# EAGLE design Roboduino DIP PTH (EAGLE 5.07)
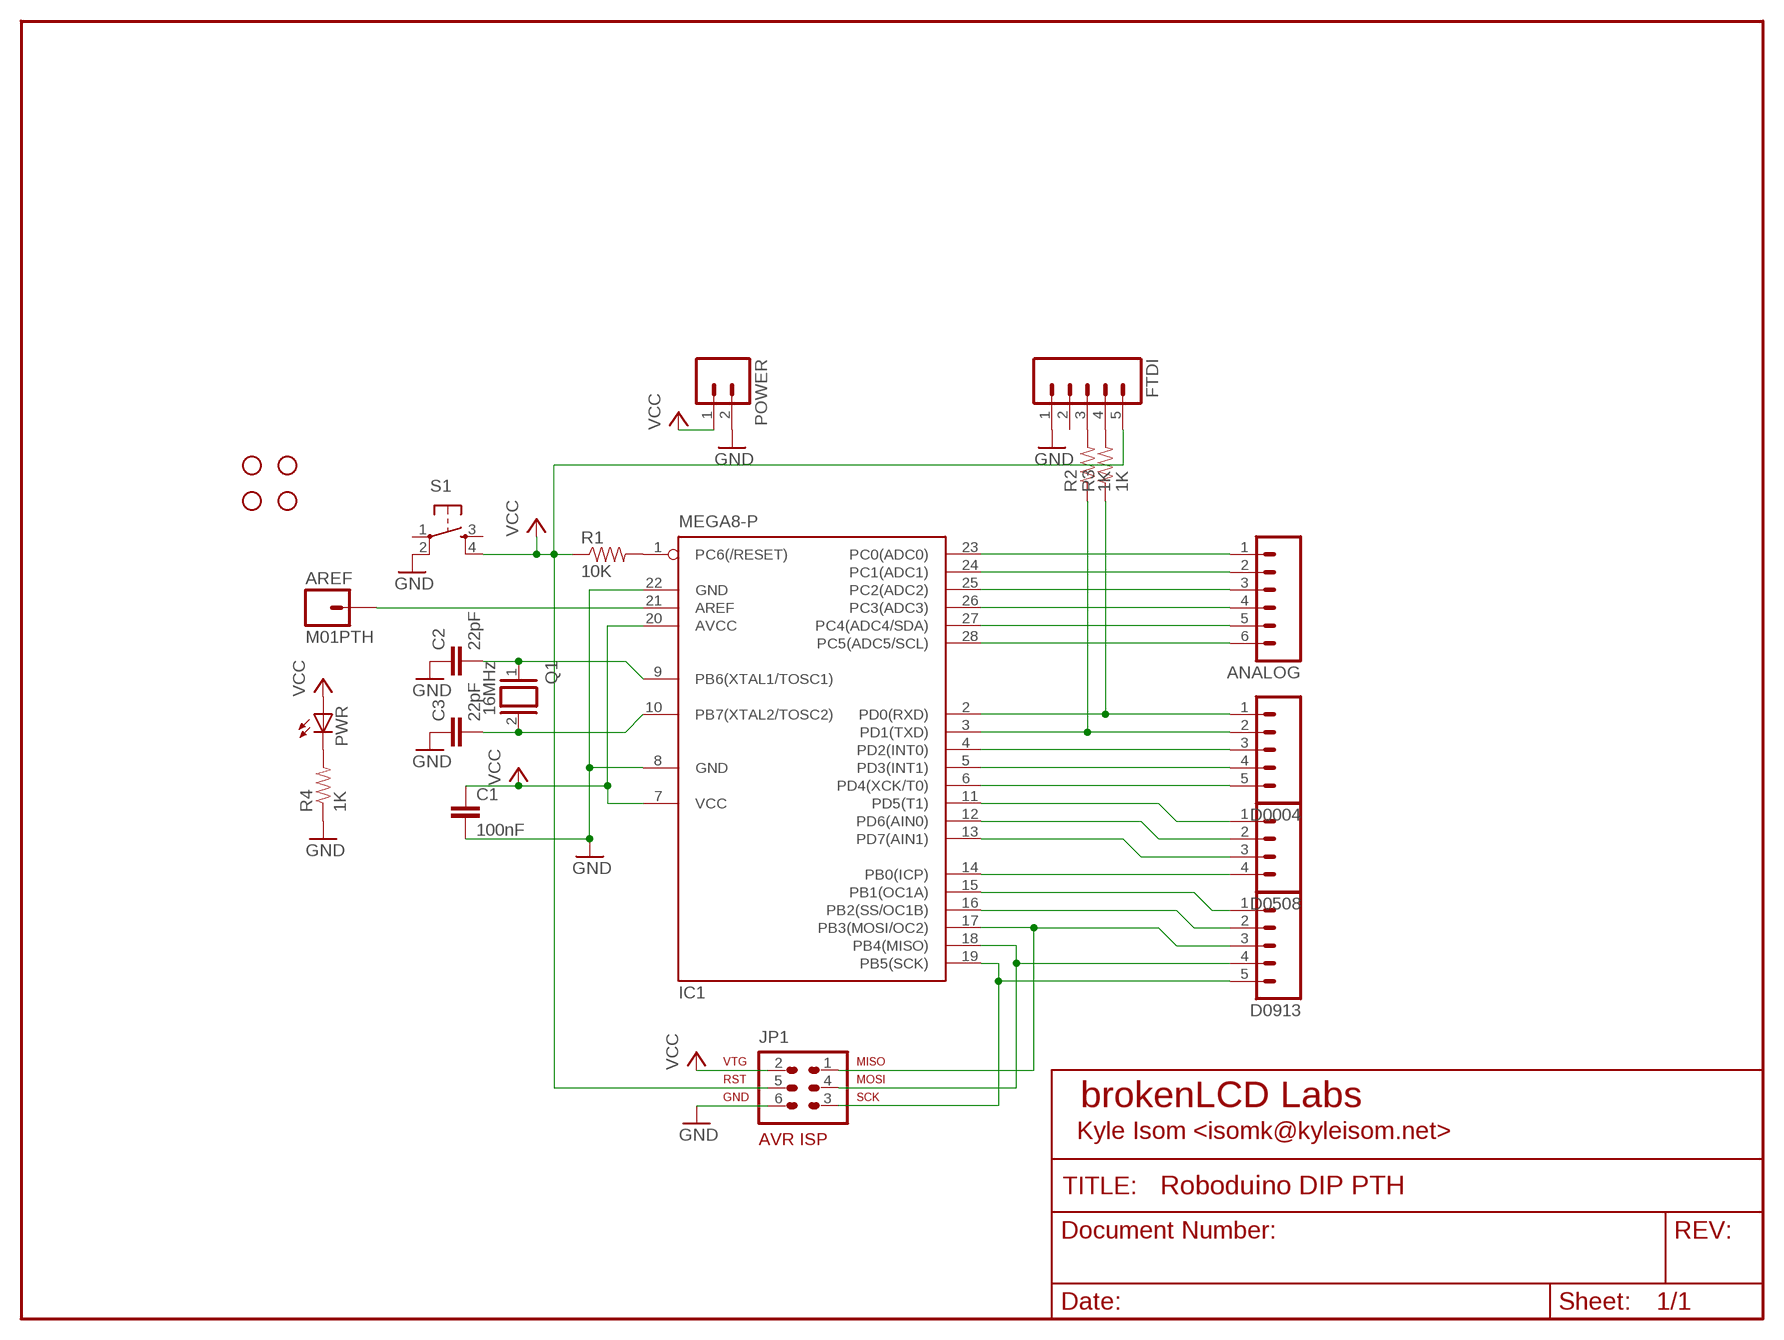
[diagram p0: schematic, sheet 1]

## Parts
ANALOG  M06LOCK  [1X06_LOCK]
AREF  M01PTH  [1X01]
C1  100nF  CAPPTH1  [CAP-PTH-5MM]
C2  22pF  CAPPTH1  [CAP-PTH-5MM]
C3  22pF  CAPPTH1  [CAP-PTH-5MM]
D0004  M05LOCK  [1X05_LOCK]
D0508  M04LOCK  [1X04_LOCK]
D0913  M05LOCK  [1X05_LOCK]
FTDI  M05LOCK  [1X05_LOCK]
IC1  MEGA8-P  [DIL28-3]
JP1  AVR-ISP-6  [AVR-ISP-6]
POWER  M02LOCK  [1X02_LOCK]
PWR  LED3MM  [LED3MM]
Q1  16MHz  XTAL/S  [QS]
R1  10K  RESISTORPTH1  [AXIAL-0.3]
R2  1K  RESISTORPTH1  [AXIAL-0.3]
R3  1K  RESISTORPTH1  [AXIAL-0.3]
R4  1K  RESISTORPTH1  [AXIAL-0.3]
S1  TAC_SWITCHPTH  [TACTILE-PTH]
U$1  STANDOFF  [STANDOFF]
U$2  STANDOFF  [STANDOFF]
U$3  STANDOFF  [STANDOFF]
U$4  STANDOFF  [STANDOFF]

## Nets
GND: C1.2 C2.1 C3.1 FTDI.1 IC1.8(GND) IC1.22(GND) JP1.6 POWER.2 R4.P$1 S1.2
N$1: IC1.1(PC6(/RESET)) R1.P$2
N$2: D0508.2 IC1.12(PD6(AIN0))
N$3: C2.2 IC1.9(PB6(XTAL1/TOSC1)) Q1.1
N$4: C3.2 IC1.10(PB7(XTAL2/TOSC2)) Q1.2
N$5: D0004.1 IC1.2(PD0(RXD)) R3.P$1
N$6: D0004.2 IC1.3(PD1(TXD)) R2.P$1
N$7: D0004.3 IC1.4(PD2(INT0))
N$8: D0004.4 IC1.5(PD3(INT1))
N$9: D0004.5 IC1.6(PD4(XCK/T0))
N$10: D0913.3 IC1.17(PB3(MOSI/OC2)) JP1.1
N$11: D0913.4 IC1.18(PB4(MISO)) JP1.4
N$12: D0913.5 IC1.19(PB5(SCK)) JP1.3
N$13: D0508.1 IC1.11(PD5(T1))
N$14: D0508.3 IC1.13(PD7(AIN1))
N$15: D0508.4 IC1.14(PB0(ICP))
N$16: D0913.1 IC1.15(PB1(OC1A))
N$17: D0913.2 IC1.16(PB2(SS/OC1B))
N$18: AREF.1 IC1.21(AREF)
N$19: ANALOG.1 IC1.23(PC0(ADC0))
N$20: ANALOG.2 IC1.24(PC1(ADC1))
N$21: ANALOG.3 IC1.25(PC2(ADC2))
N$22: ANALOG.4 IC1.26(PC3(ADC3))
N$23: ANALOG.5 IC1.27(PC4(ADC4/SDA))
N$24: ANALOG.6 IC1.28(PC5(ADC5/SCL))
N$25: PWR.K(C) R4.P$2
N$26: FTDI.3 R2.P$2
N$27: FTDI.4 R3.P$2
VCC: C1.1 FTDI.5 IC1.7(VCC) IC1.20(AVCC) JP1.2 JP1.5 POWER.1 PWR.A R1.P$1 S1.4
Unconnected: FTDI.2 S1.1 S1.3

## Notes on the sheet
- brokenLCD Labs
- Kyle Isom <isomk@kyleisom.net>

## Library data of the parts
ANALOG = SparkFun:M06: Header 6 Standard 6-pin 0.1" header. Use with straight break away headers (SKU : PRT-00116), right angle break away headers (PRT-00553), swiss pins (PRT-00743), machine pins (PRT-00117), and female headers (PRT-00115). Molex polarized connector foot print use with SKU : PRT-08094 with associated crimp pins and housings. NOTES ON THE VARIANTS LOCK and LOCK_LONGPADS... This footprint was designed to help hold the alignment of a through-hole component (i.e. 6-pin header) while soldering it into place. You may notice that each hole has been shifted either up or down by 0.005 of an inch from it's more standard position (which is a perfectly straight line). This slight alteration caused the pins (the squares in the middle) to touch the edges of the holes. Because they are alternating, it causes a "brace" to hold the component in place. 0.005 has proven to be the perfect amount of "off-center" position when using our standard breakaway headers. Although looks a little odd when you look at the bare footprint, once you have a header in there, the alteration is very hard to notice. Also, if you push a header all the way into place, it is covered up entirely on the bottom side. This idea of altering the position of holes to aid alignment will be further integrated into the Sparkfun Library for other footprints. It can help hold any component with 3 or more connection pins.
AREF = SparkFun:M01: Header 1 Standard 1-pin 0.1" header. Use with straight break away headers (SKU : PRT-00116), right angle break away headers (PRT-00553), swiss pins (PRT-00743), machine pins (PRT-00117), and female headers (PRT-00115).
C1-C3 = SparkFun:CAP: Capacitor Standard 0603 ceramic capacitor, and 0.1" leaded capacitor.
D0004 D0913 FTDI = SparkFun:M05: Header 5 Standard 5-pin 0.1" header. Use with straight break away headers (SKU : PRT-00116), right angle break away headers (PRT-00553), swiss pins (PRT-00743), machine pins (PRT-00117), and female headers (PRT-00115). Molex polarized connector foot print use with SKU : PRT-08230 with associated crimp pins and housings.
D0508 = SparkFun:M04: Header 4 Standard 4-pin 0.1" header. Use with straight break away headers (SKU : PRT-00116), right angle break away headers (PRT-00553), swiss pins (PRT-00743), machine pins (PRT-00117), and female headers (PRT-00115). Molex polarized connector foot print use with SKU : PRT-08231 with associated crimp pins and housings.
IC1 = atmel:MEGA8-P: MICROCONTROLLER 8 Kbytes FLASH, 1 kbytes SRAM, 512 bytes EEPROM, USART, 4-channel 10 bit ADC, 2-channel 8 bit ADC Pin compatible with Atmega48, ATMega88, ATMega168 Source: avr.lbr
JP1 = avr-6:AVR-ISP-6: AVR ISP-6 Serial Programming Header
POWER = SparkFun:M02: Header 2 Standard 2-pin 0.1" header. Use with straight break away headers (SKU : PRT-00116), right angle break away headers (PRT-00553), swiss pins (PRT-00743), machine pins (PRT-00117), and female headers (PRT-00115). Molex polarized connector foot print use with SKU : PRT-08233 with associated crimp pins and housings.
PWR = led:LED: LED OSRAM: - CHIPLED LG R971, LG N971, LY N971, LG Q971, LY Q971, LO R971, LY R971 LH N974, LH R974 LS Q976, LO Q976, LY Q976 LO Q996 - Hyper CHIPLED LW Q18S LB Q993, LB Q99A, LB R99A - SideLED LS A670, LO A670, LY A670, LG A670, LP A670 LB A673, LV A673, LT A673, LW A673 LH A674 LY A675 LS A676, LA A676, LO A676, LY A676, LW A676 LS A679, LY A679, LG A679 - Hyper Micro SIDELED® LS Y876, LA Y876, LO Y876, LY Y876 LT Y87S - SmartLED LW L88C, LW L88S LB L89C, LB L89S, LG L890 LS L89K, LO L89K, LY L89K LS L896, LA L896, LO L896, LY L896 - TOPLED LS T670, LO T670, LY T670, LG T670, LP T670 LSG T670, LSP T670, LSY T670, LOP T670, LYG T670 LG T671, LOG T671, LSG T671 LB T673, LV T673, LT T673, LW T673 LH T674 LS T676, LA T676, LO T676, LY T676, LB T676, LH T676, LSB T676, LW T676 LB T67C, LV T67C, LT T67C, LS T67K, LO T67K, LY T67K, LW E67C LS E67B, LA E67B, LO E67B, LY E67B, LB E67C, LV E67C, LT E67C LW T67C LS T679, LY T679, LG T679 LS T770, LO T770, LY T770, LG T770, LP T770 LB T773, LV T773, LT T773, LW T773 LH T774 LS E675, LA E675, LY E675, LS T675 LS T776, LA T776, LO T776, LY T776, LB T776 LHGB T686 LT T68C, LB T68C - Hyper Mini TOPLED® LB M676 - Mini TOPLED Santana® LG M470 LS M47K, LO M47K, LY M47K Source: http://www.osram.convergy.de LUXEON: - LUMILED® LXK2-PW12-R00, LXK2-PW12-S00, LXK2-PW14-U00, LXK2-PW14-V00 LXK2-PM12-R00, LXK2-PM12-S00, LXK2-PM14-U00 LXK2-PE12-Q00, LXK2-PE12-R00, LXK2-PE12-S00, LXK2-PE14-T00, LXK2-PE14-U00 LXK2-PB12-K00, LXK2-PB12-L00, LXK2-PB12-M00, LXK2-PB14-N00, LXK2-PB14-P00, LXK2-PB14-Q00 LXK2-PR12-L00, LXK2-PR12-M00, LXK2-PR14-Q00, LXK2-PR14-R00 LXK2-PD12-Q00, LXK2-PD12-R00, LXK2-PD12-S00 LXK2-PH12-R00, LXK2-PH12-S00 LXK2-PL12-P00, LXK2-PL12-Q00, LXK2-PL12-R00 Source: www.luxeon.com KINGBRIGHT: KA-3528ASYC Source: www.kingbright.com
Q1 = special:XTAL/S: CRYSTAL
R1-R4 = SparkFun:RESISTOR: Resistor Basic schematic elements and footprints for 0603, 1206, and PTH 1/10th watt (small) resistors.
S1 = SparkFun:TAC_SWITCH: Momentary Switch Button commonly used for reset or general input. Spark Fun Electronics SKU : COM-00097
U$1-U$4 = brokenlcd:STANDOFF

## Board
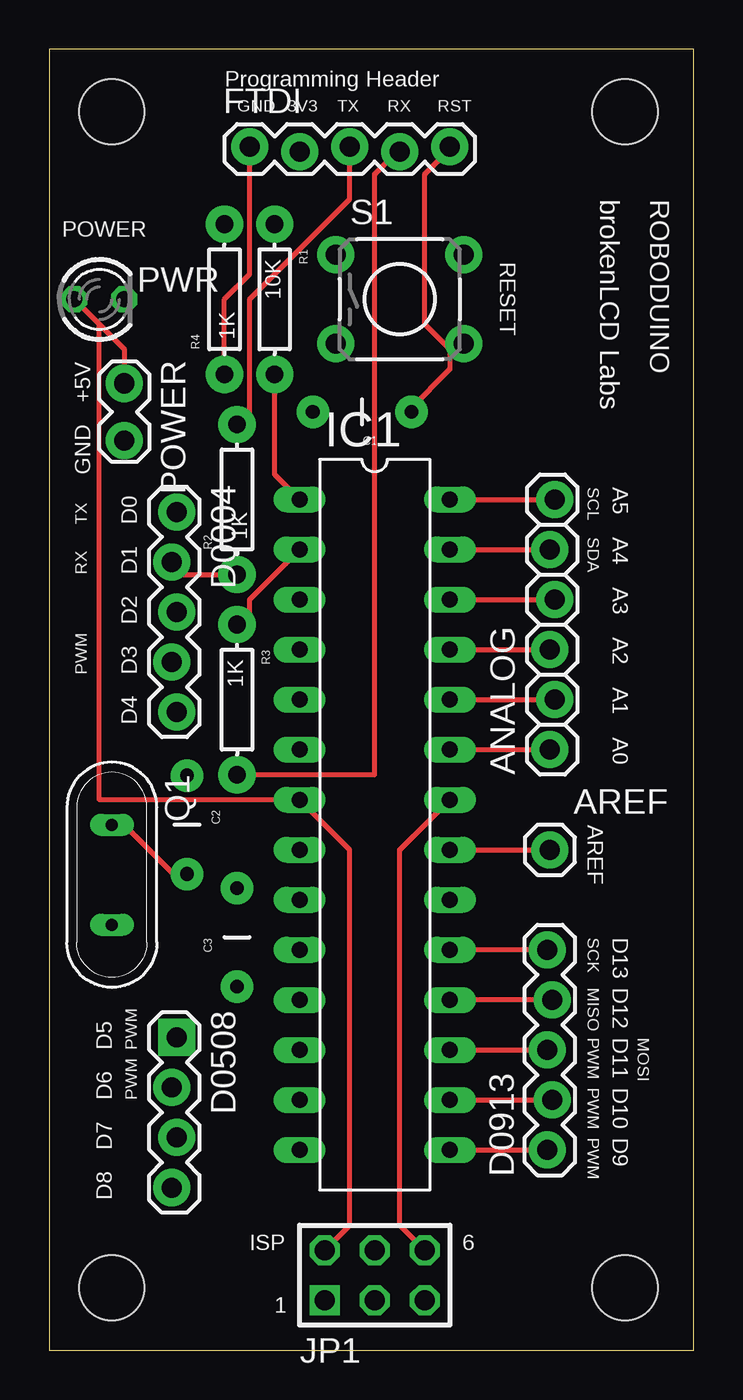
[diagram p1: board, top side]
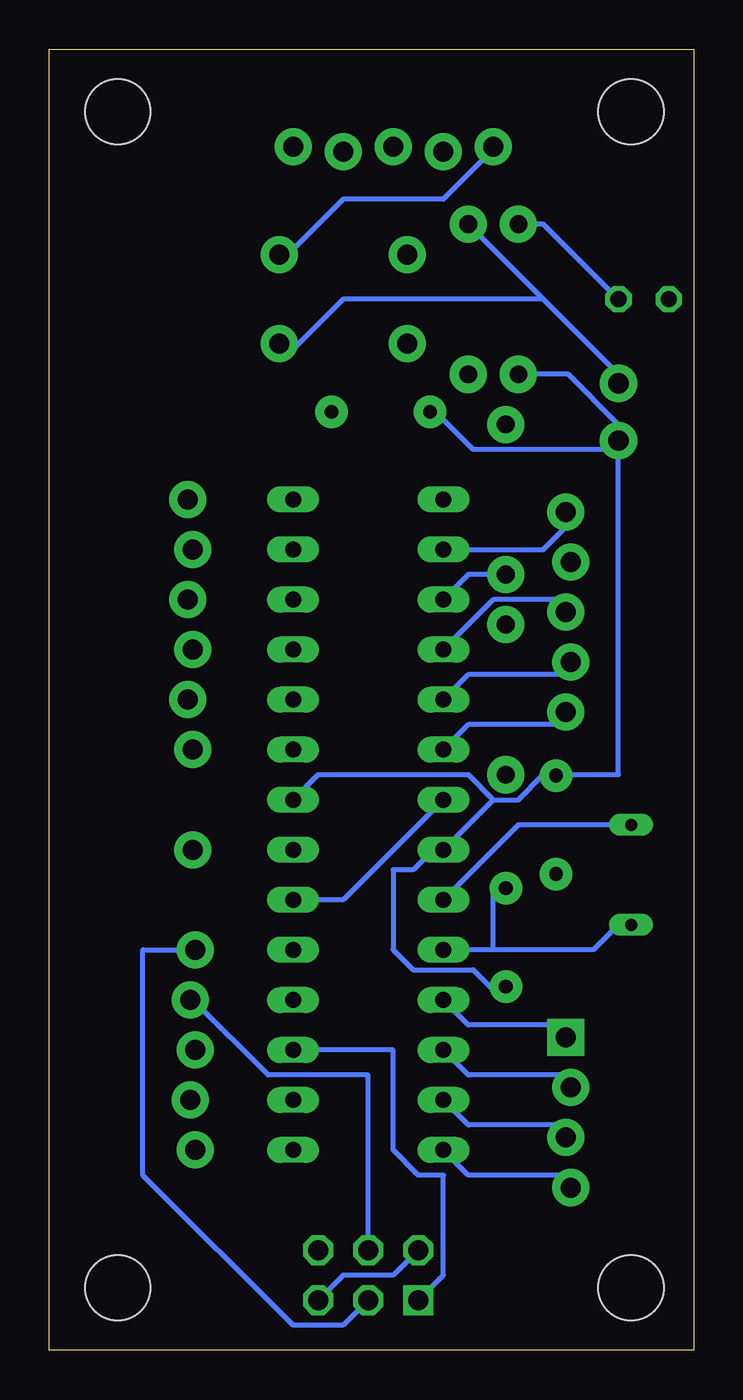
[diagram p2: board, bottom side, seen from below]

Size 32.69 x 66.03 mm. Coordinates in mm from the lower left corner, seen from the top.
Outline: 0,0 32.69,0 32.69,66.03 0,66.03 0,0
Copper layers (1*16): Top 0.035mm / dielectric 1.5mm / Bottom 0.035mm
Design rules "default": minimum track width 10mil, minimum drill 24mil, track to track 8mil, track to pad 8mil, pad to pad 8mil, via to via 8mil, smd to smd 8mil, copper to edge 40mil, drill to drill 8mil, minimum pad ring 10mil, minimum via ring 8mil, stop-mask expansion 4mil, vias tented up to drill 0mil, thermal gap 10mil

### Footprints (pad centres in the part's own frame; a part is rotated, then mirrored left to right if it is on the bottom)
1X06_LOCK = drill 1.016 pad 1.88 round: 1 0,0; 2 2.54,-0.254; 3 5.08,0; 4 7.62,-0.254; 5 10.16,0; 6 12.7,-0.254
1X01 = drill 1.016 pad 1.88 round: 1 0,0
CAP-PTH-5MM = drill 0.7 pad 1.651 round: 1 -2.5,0; 2 2.5,0
1X05_LOCK = drill 1.016 pad 1.88 round: 1 0,0.127; 2 2.54,-0.127; 3 5.08,0.127; 4 7.62,-0.127; 5 10.16,0.127
1X04_LOCK = drill 1.016 pad 1.88 square: 1 0,0.127 | drill 1.016 pad 1.88 round: 2 2.54,-0.127; 3 5.08,0.127; 4 7.62,-0.127
DIL28-3 = drill 0.813 long: 1 -16.51,-3.81; 2 -13.97,-3.81; 3 -11.43,-3.81; 4 -8.89,-3.81; 5 -6.35,-3.81; 6 -3.81,-3.81; 7 -1.27,-3.81; 8 1.27,-3.81; 9 3.81,-3.81; 10 6.35,-3.81; 11 8.89,-3.81; 12 11.43,-3.81; 13 13.97,-3.81; 14 16.51,-3.81; 15 16.51,3.81; 16 13.97,3.81; 17 11.43,3.81; 18 8.89,3.81; 19 6.35,3.81; 20 3.81,3.81; 21 1.27,3.81; 22 -1.27,3.81; 23 -3.81,3.81; 24 -6.35,3.81; 25 -8.89,3.81; 26 -11.43,3.81; 27 -13.97,3.81; 28 -16.51,3.81
AVR-ISP-6 = drill 1.016 square: 1 -2.54,-1.27 | drill 1.016 octagon: 2 -2.54,1.27; 3 0,-1.27; 4 0,1.27; 5 2.54,-1.27; 6 2.54,1.27
1X02_LOCK = drill 1.016 pad 1.88 round: 1 -0.178,0; 2 2.718,0
LED3MM = drill 0.813 octagon: A -1.27,0; K 1.27,0
QS = drill 0.61 long: 1 -2.54,0; 2 2.54,0
AXIAL-0.3 = drill 0.9 pad 1.88 round: P$1 -3.81,0; P$2 3.81,0
TACTILE-PTH = drill 1.016 pad 1.88 round: 1 -3.251,2.261; 2 3.251,2.261; 3 -3.251,-2.261; 4 3.251,-2.261
STANDOFF = hole 3.302: 0,0

### Placement (x,y rotation side)
ANALOG  25.4,30.48 90 top
AREF  25.4,25.4 0 top
C1  15.88,47.62 180 top
C2  6.99,26.67 270 top
C3  9.53,20.95 90 top
D0004  6.35,42.55 270 top
D0508  6.35,15.88 270 top
D0913  25.4,10.16 90 top
FTDI  10.16,60.96 0 top
IC1  16.51,26.67 270 top
JP1  16.51,3.81 0 top
POWER  3.81,48.9 270 top
PWR  2.54,53.34 0 top
Q1  3.17,24.13 270 top
R1  11.43,53.34 270 top
R2  9.53,43.18 90 top
R3  9.53,33.02 270 top
R4  8.89,53.34 90 top
S1  17.78,53.34 0 top
U$1  3.17,3.17 0 top
U$2  3.17,62.87 0 top
U$3  29.21,3.17 0 top
U$4  29.21,62.87 0 top

### Tracks (layer width: path | path; a pad name or v marks a point on that pad's centre or on a via)
GND
  Top 0.254: R4.P$1 8.89,53.34 10.16,54.61 FTDI.1 | JP1.6 17.78,6.35 17.78,25.4 IC1.22
  Bottom 0.254: R4.P$1 6.35,49.53 3.81,46.99 POWER.2 | S1.2 20.32,55.88 17.78,58.42 12.7,58.42 10.16,60.96 FTDI.1 | 10.16,27.94 IC1.8 13.21,25.4 14.22,24.38 15.24,24.38 15.24,20.32 14.22,19.3 11.18,19.3 10.16,18.29 C3.1 | 10.16,27.94 8.89,27.94 7.62,29.21 C2.1 6.35,29.21 3.81,29.21 POWER.2 | IC1.22 19.05,29.21 11.43,29.21 10.16,27.94 | C1.2 13.21,47.75 11.18,45.72 4.06,45.72 POWER.2
N$1
  Top 0.254: IC1.1 11.43,44.45 R1.P$2
N$2
  Bottom 0.254: IC1.12 11.43,13.97 6.35,13.97 D0508.2
N$3
  Top 0.254: Q1.1 3.81,26.67 6.35,24.13 C2.2
  Bottom 0.254: IC1.9 8.89,26.67 Q1.1
N$4
  Bottom 0.254: 10.16,20.32 5.08,20.32 3.81,21.59 Q1.2 | 10.16,20.32 IC1.10 | 10.16,20.32 10.16,23.37 C3.2
N$5
  Top 0.254: IC1.2 10.16,38.1 10.16,36.83 R3.P$1
  Bottom 0.254: IC1.2 7.62,40.64 6.35,41.91 D0004.1
N$6
  Top 0.254: D0004.2 6.35,39.37 R2.P$1
  Bottom 0.254: IC1.3 11.43,39.37 R2.P$1
N$7
  Bottom 0.254: IC1.4 10.16,38.1 6.35,38.1 D0004.3
N$8
  Bottom 0.254: IC1.5 11.43,34.29 6.35,34.29 D0004.4
N$9
  Bottom 0.254: IC1.6 11.43,31.75 6.35,31.75 D0004.5
N$10
  Top 0.254: IC1.17 D0913.3 25.4,15.24
  Bottom 0.254: JP1.1 12.7,3.81 12.7,8.89 13.97,8.89 15.24,10.16 15.24,15.24 IC1.17
N$11
  Top 0.254: D0913.4 IC1.18
  Bottom 0.254: JP1.4 16.51,13.97 21.59,13.97 25.4,17.78 D0913.4
N$12
  Top 0.254: IC1.19 D0913.5 25.4,20.32
  Bottom 0.254: JP1.3 17.78,1.27 20.32,1.27 27.94,8.89 27.94,20.32 D0913.5
N$13
  Bottom 0.254: IC1.11 11.43,16.51 6.35,16.51 D0508.1
N$14
  Bottom 0.254: IC1.13 11.43,11.43 6.35,11.43 D0508.3
N$15
  Bottom 0.254: IC1.14 11.43,8.89 6.35,8.89 D0508.4
N$16
  Top 0.254: IC1.15 D0913.1 25.4,10.16
N$17
  Top 0.254: IC1.16 D0913.2
N$18
  Top 0.254: IC1.21 AREF.1
N$19
  Top 0.254: IC1.23 ANALOG.1
N$20
  Top 0.254: IC1.24 ANALOG.2
N$21
  Top 0.254: IC1.25 ANALOG.3
N$22
  Top 0.254: IC1.26 ANALOG.4
N$23
  Top 0.254: IC1.27 ANALOG.5
N$24
  Top 0.254: IC1.28 ANALOG.6
N$25
  Bottom 0.254: PWR.K 7.62,57.15 R4.P$2
N$26
  Top 0.254: R2.P$2 10.16,46.99 10.16,53.34 15.24,58.42 FTDI.3
N$27
  Top 0.254: R3.P$2 16.51,29.21 16.51,59.69 17.78,60.96 FTDI.4
VCC
  Top 0.254: JP1.2 15.24,6.35 15.24,25.4 IC1.7 2.54,27.94 2.54,52.07 | 2.54,52.07 3.81,50.8 POWER.1 | 2.54,52.07 PWR.A | 20.32,50.8 19.05,52.07 19.05,59.69 20.32,60.96 FTDI.5 | 20.32,50.8 20.32,49.78 18.29,47.75 C1.1 | S1.4 20.32,50.8
  Bottom 0.254: JP1.2 15.24,3.81 17.78,3.81 JP1.5 | IC1.7 17.78,22.86 IC1.20 | 7.62,53.34 3.81,49.53 POWER.1 | 7.62,53.34 R1.P$1 | 7.62,53.34 17.78,53.34 20.32,50.8 S1.4

### Text on the board
tPlace: Programming Header | GND | 3V3 | TX | RX | RST | brokenLCD Labs | ROBODUINO | POWER | RESET | +5V | GND | SCL | A5 | TX | D0 | SDA | A4 | RX | D1 | A3 | D2 | A2 | PWM | D3 | A1 | D4 | A0 | AREF | SCK | D13 | MISO | D12 | PWM | D11 | MOSI | D5 | PWM | D6 | PWM | PWM | D10 | PWM | D9 | D7 | D8 | ISP | 6 | 1